# Altium schematic sheet SubBus1.SchDoc
size A
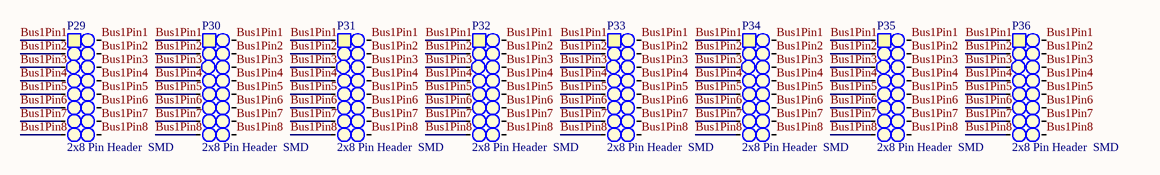
[diagram p0: SubBus1.SchDoc]

## Parts
P29  2x8 Pin Header  SMD  [2X8_SMD_PH_2.54]
P30  2x8 Pin Header  SMD  [2X8_SMD_PH_2.54]
P31  2x8 Pin Header  SMD  [2X8_SMD_PH_2.54]
P32  2x8 Pin Header  SMD  [2X8_SMD_PH_2.54]
P33  2x8 Pin Header  SMD  [2X8_SMD_PH_2.54]
P34  2x8 Pin Header  SMD  [2X8_SMD_PH_2.54]
P35  2x8 Pin Header  SMD  [2X8_SMD_PH_2.54]
P36  2x8 Pin Header  SMD  [2X8_SMD_PH_2.54]

## Nets
Bus1Pin1: P29.1 P29.16 P30.1 P30.16 P31.1 P31.16 P32.1 P32.16 P33.1 P33.16 P34.1 P34.16 P35.1 P35.16 P36.1 P36.16
Bus1Pin2: P29.2 P29.15 P30.2 P30.15 P31.2 P31.15 P32.2 P32.15 P33.2 P33.15 P34.2 P34.15 P35.2 P35.15 P36.2 P36.15
Bus1Pin3: P29.3 P29.14 P30.3 P30.14 P31.3 P31.14 P32.3 P32.14 P33.3 P33.14 P34.3 P34.14 P35.3 P35.14 P36.3 P36.14
Bus1Pin4: P29.4 P29.13 P30.4 P30.13 P31.4 P31.13 P32.4 P32.13 P33.4 P33.13 P34.4 P34.13 P35.4 P35.13 P36.4 P36.13
Bus1Pin5: P29.5 P29.12 P30.5 P30.12 P31.5 P31.12 P32.5 P32.12 P33.5 P33.12 P34.5 P34.12 P35.5 P35.12 P36.5 P36.12
Bus1Pin6: P29.6 P29.11 P30.6 P30.11 P31.6 P31.11 P32.6 P32.11 P33.6 P33.11 P34.6 P34.11 P35.6 P35.11 P36.6 P36.11
Bus1Pin7: P29.7 P29.10 P30.7 P30.10 P31.7 P31.10 P32.7 P32.10 P33.7 P33.10 P34.7 P34.10 P35.7 P35.10 P36.7 P36.10
Bus1Pin8: P29.8 P29.9 P30.8 P30.9 P31.8 P31.9 P32.8 P32.9 P33.8 P33.9 P34.8 P34.9 P35.8 P35.9 P36.8 P36.9

## Library data of the parts
P29-P36 = 2x8 Pin Header  SMD: 2.54mm, SMD; Value: 2x8 Pin Header, 2.54mm, SMD; Farnell: 2356242